# Altium schematic sheet OSCILLAR_HFB_V1p0_LVL.SchDoc
size A4; SheetNumber: 10; SheetTotal: 13; Title_: Aux Gain Stabilization Block
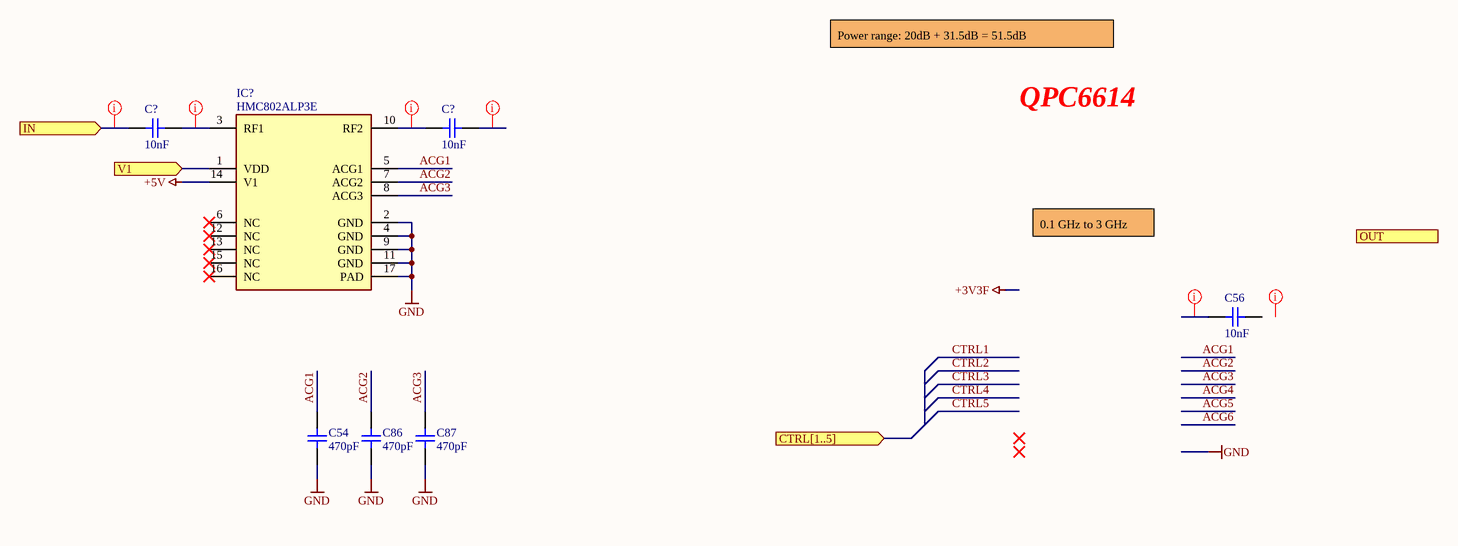
[diagram p0: OSCILLAR_HFB_V1p0_LVL.SchDoc]

## Parts
(Parts that share a designator on the sheet are numbered #1, #2 ... from top to bottom, then left to right.)
C54  470pF  [CAP_0603]
C56  10nF  [CAP_0603]
C86  470pF  [CAP_0603]
C87  470pF  [CAP_0603]
C?#1  10nF  [CAP_0603]
C?#2  10nF  [CAP_0603]
IC?  HMC802ALP3E  [QFN-16]

## Ports
CTRL[1..5] (in, see OSCILLAR_HFB_V1p0_MAIN), IN (in, see OSCILLAR_HFB_V1p0_MAIN), OUT (out, see OSCILLAR_HFB_V1p0_MAIN), V1 (in)

## Nets
+5V: IC?.14(V1)
GND: C54.2 C86.2 C87.2 IC?.2(GND) IC?.4(GND) IC?.9(GND) IC?.11(GND) IC?.17(PAD)
ACG1: C54.1 IC?.5(ACG1)
ACG2: C86.1 IC?.7(ACG2)
ACG3: C87.1 IC?.8(ACG3)
IN: C?#1.2 ; port IN
V1: IC?.1(VDD) ; port V1
NetC?#1_1: C?#1.1 IC?.3(RF1)
NetC?#2_2: C?#2.2 IC?.10(RF2)

Not connected (* = marked no-connect by the designer): C56 1 2; C?#2 1; IC? 6(NC)* 12(NC)* 13(NC)* 15(NC)* 16(NC)*

## Layout directives
net class 50R: (no net found under the mark), IN, NetC56_2, NetC?#1_1, NetC?#2_1, NetC?#2_2

## Notes on the sheet
- Power range: 20dB + 31.5dB = 51.5dB
- QPC6614
- 0.1 GHz to 3 GHz
- Board:
- Author:
- Title:
- Project:
- SVN:
- Version:
- Sheet:
- of
- Contact:
- Modified:
- Size:
- A4

## Library data of the parts
C54 C56 C86 C87 C?#1 C?#2 = NP-CAPACITOR: MLCC capacitor; Type: CAP
IC? = HMC802ALP3E: Attenuator, DC-6000MHz DATT 1 bit 20dB; Part number: 584-HMC802ALP3E; Supplier: Mouser; Type: IC; ComponentLink1Description: Datasheet; ComponentLink2Description: Order; ComponentLink2URL: https://hu.mouser.com/ProductDetail/Analog-Devices/HMC802ALP3E?qs=JeIcUl65ClAAleVEB%252BGkCg%3D%3D